# EAGLE schematic envirodinges (EAGLE 7.7.0)
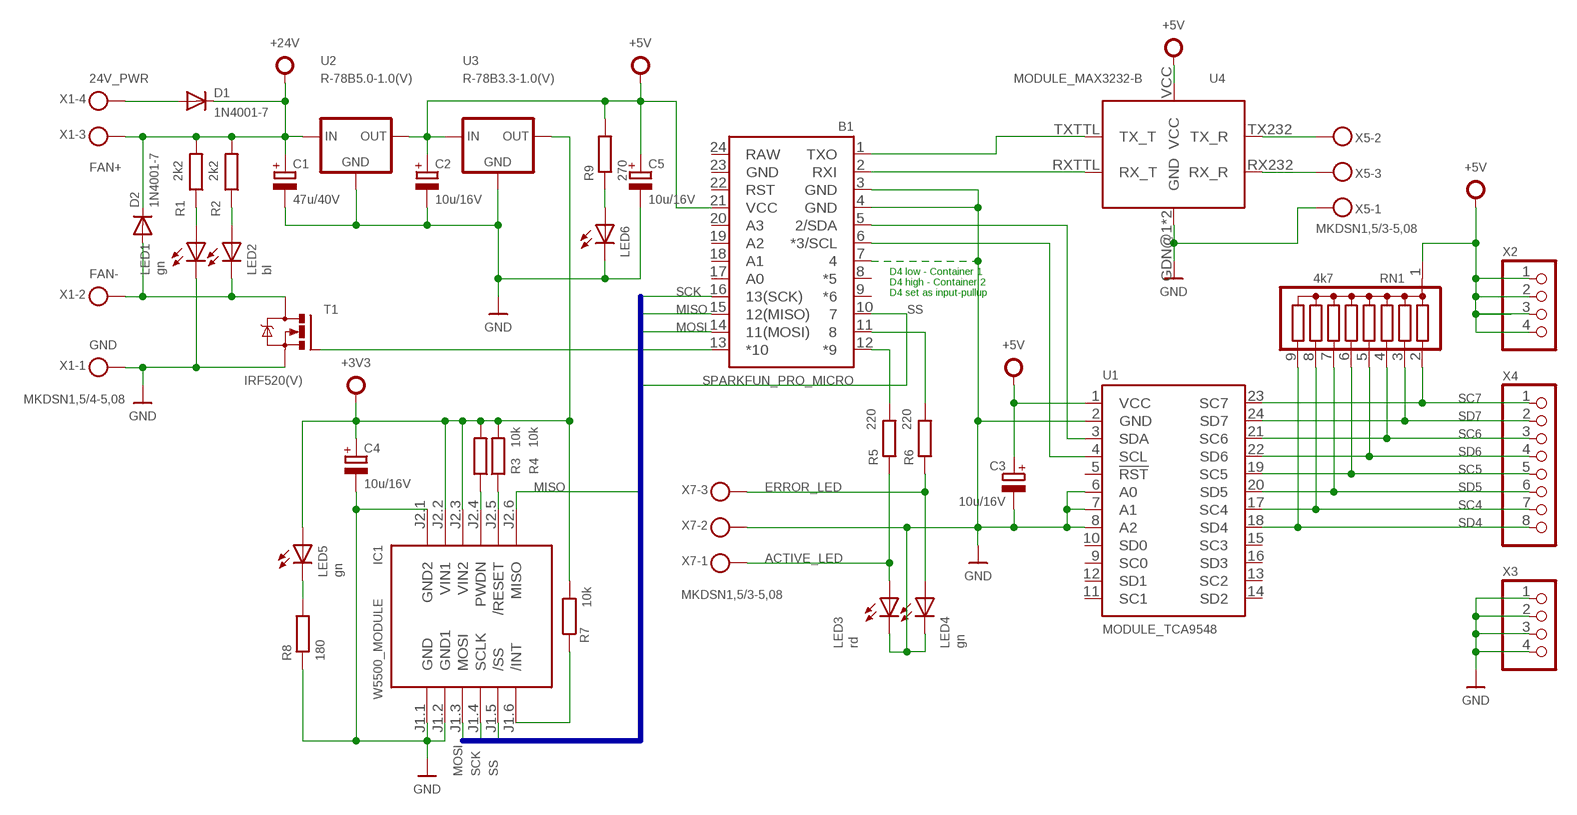
[diagram p0: schematic, sheet 1]

## Parts
B1  SPARKFUN_PRO_MICRO  [SPARKFUN_PRO_MICRO]
C1  47u/40V  CPOL-EUE5-4  [E5-4]
C2  10u/16V  CPOL-EUE5-4  [E5-4]
C3  10u/16V  CPOL-EUE5-4  [E5-4]
C4  10u/16V  CPOL-EUE5-4  [E5-4]
C5  10u/16V  CPOL-EUE5-4  [E5-4]
D1  1N4001-7  [DO41-7]
D2  1N4001-7  [DO41-7]
IC1  W5500_MODULE  WIZ820IO_DEVICE  [WIZ820IO]
LED1  gn  LED-3MM  [LED3MM]
LED2  bl  LED-3MM  [LED3MM]
LED3  rd  LED-3MM  [LED3MM]
LED4  gn  LED-3MM  [LED3MM]
LED5  gn  LED-3MM  [LED3MM]
LED6  LED-3MM  [LED3MM]
R1  2k2  R-EU0207/10  [0207/10]
R2  2k2  R-EU0207/10  [0207/10]
R3  10k  R-EU0207/10  [0207/10]
R4  10k  R-EU0207/10  [0207/10]
R5  220  R-EU0207/10  [0207/10]
R6  220  R-EU0207/10  [0207/10]
R7  10k  R-EU0207/10  [0207/10]
R8  180  R-EU0207/10  [0207/10]
R9  270  R-EU0207/10  [0207/10]
RN1  4k7  G08R  [SIL9]
T1  IRF520(V)  [TO220V]
U1  MODULE_TCA9548  TCA9548  [TCA9548]
U2  R-78B5.0-1.0(V)  [SIP3V]
U3  R-78B3.3-1.0(V)  [SIP3V]
U4  MODULE_MAX3232-B  [MAX3232-B]
X1  MKDSN1,5/4-5,08  [MKDSN1,5/4-5,08]
X2  MPT4  [4POL254]
X3  MPT4  [4POL254]
X4  MPT8  [8POL254]
X5  MKDSN1,5/3-5,08  [MKDSN1,5/3-5,08]
X7  MKDSN1,5/3-5,08  [MKDSN1,5/3-5,08]

## Nets
24V_PWR: D1.A X1.4
+3V3: C4.+ IC1.J2.2(VIN1) IC1.J2.3(VIN2) LED5.A R3.2 R4.2 R7.2 U3.3(OUT)
+5V: B1.21(VCC) C2.+ C3.+ C5.+ R9.2 RN1.1 U1.1(VCC) U2.3(OUT) U3.1(IN) U4.VCC X2.1 X2.2 X2.3 X2.4
ACTIVE_LED: LED3.A R5.1 X7.1
ERROR_LED: LED4.A R6.1 X7.3
FAN+: C1.+ D1.C D2.C R1.2 R2.2 U2.1(IN) X1.3 ; supply symbol labelled +24V
FAN-: D2.A LED2.K(C) T1.2(D) X1.2
GND: B1.3(GND) B1.4(GND) B1.7 C1.- C2.- C3.- C4.- C5.- IC1.J1.1(GND) IC1.J1.2(GND1) IC1.J2.1(GND2) LED1.K(C) LED3.K(C) LED4.K(C) LED6.K(C) R8.1 T1.3(S) U1.2(GND) U1.6(A0) U1.7(A1) U1.8(A2) U2.2(GND) U3.2(GND) U4.GDN@1(GND) U4.GND X1.1 X3.1 X3.2 X3.3 X3.4 X5.1 X7.2
MISO: B1.15(12(MISO)) IC1.J2.6(MISO)
MOSI: B1.14(11(MOSI)) IC1.J1.3(MOSI)
N$1: IC1.J1.6(/INT) R7.1
N$2: LED6.A R9.1
N$3: U4.RX232(RX_R) X5.3
N$4: LED5.K(C) R8.2
N$5: U4.TX232(TX_R) X5.2
N$9: IC1.J2.4(PWDN) R3.1
N$10: B1.5(2/SDA) U1.3(SDA)
N$11: B1.6(*3/SCL) U1.4(SCL)
N$12: IC1.J2.5(/RESET) R4.1
N$13: B1.13(*10) T1.1(G)
N$14: LED1.A R1.1
N$15: B1.1(TXO) U4.TXTTL(TX_T)
N$16: B1.2(RXI) U4.RXTTL(RX_T)
N$19: LED2.A R2.1
N$24: B1.12(*9) R5.2
N$25: B1.11 R6.2
SC4: RN1.8 U1.17(SC4) X4.7
SC5: RN1.6 U1.19(SC5) X4.5
SC6: RN1.4 U1.21(SC6) X4.3
SC7: RN1.2 U1.23(SC7) X4.1
SCK: B1.16(13(SCK)) IC1.J1.4(SCLK)
SD4: RN1.9 U1.18(SD4) X4.8
SD5: RN1.7 U1.20(SD5) X4.6
SD6: RN1.5 U1.22(SD6) X4.4
SD7: RN1.3 U1.24(SD7) X4.2
SS: B1.10 IC1.J1.5(/SS)
Unconnected: B1.8(*5) B1.9(*6) B1.17(A0) B1.18(A1) B1.19(A2) B1.20(A3) B1.22(RST) U1.5(!RST) U1.9(SC0) U1.10(SD0) U1.11(SC1) U1.12(SD1) U1.13(SC2) U1.14(SD2) U1.15(SC3) U1.16(SD3)

## Buses
MOSI,MISO,SCK,SS

## Notes on the sheet
- D4 low - Container 1
  D4 high - Container 2
  D4 set as input-pullup

## Power pins joined to a net without a drawn wire
GND: B1.23(GND)
RAW: B1.24(RAW)

## Library data of the parts
B1 = SparkFun-Boards:SPARKFUN_PRO_MICRO: SparkFun Pro Micro Atmega32U4 compatible footprint. SparkFun Products: 3.3V/8MHz <https://www.sparkfun.com/products/12587> 5V/16MHz <https://www.sparkfun.com/products/12640>
C1-C5 = rcl-rs:CPOL-EU: POLARIZED CAPACITOR, European symbol
D1 D2 = diode-rs:1N400*: DIODE general purpose rectifier, 1 A
IC1 = wiznet:WIZ820IO_DEVICE: WIZnet, WIZ820io plug in module incl. W5200 chip and MagJack
LED1-LED6 = led-rs:LED: LED OSRAM: - CHIPLED LG R971, LG N971, LY N971, LG Q971, LY Q971, LO R971, LY R971 LH N974, LH R974 LS Q976, LO Q976, LY Q976 LO Q996 - Hyper CHIPLED LW Q18S LB Q993, LB Q99A, LB R99A - SideLED LS A670, LO A670, LY A670, LG A670, LP A670 LB A673, LV A673, LT A673, LW A673 LH A674 LY A675 LS A676, LA A676, LO A676, LY A676, LW A676 LS A679, LY A679, LG A679 - Hyper Micro SIDELED® LS Y876, LA Y876, LO Y876, LY Y876 LT Y87S - SmartLED LW L88C, LW L88S LB L89C, LB L89S, LG L890 LS L89K, LO L89K, LY L89K LS L896, LA L896, LO L896, LY L896 - TOPLED LS T670, LO T670, LY T670, LG T670, LP T670 LSG T670, LSP T670, LSY T670, LOP T670, LYG T670 LG T671, LOG T671, LSG T671 LB T673, LV T673, LT T673, LW T673 LH T674 LS T676, LA T676, LO T676, LY T676, LB T676, LH T676, LSB T676, LW T676 LB T67C, LV T67C, LT T67C, LS T67K, LO T67K, LY T67K, LW E67C LS E67B, LA E67B, LO E67B, LY E67B, LB E67C, LV E67C, LT E67C LW T67C LS T679, LY T679, LG T679 LS T770, LO T770, LY T770, LG T770, LP T770 LB T773, LV T773, LT T773, LW T773 LH T774 LS E675, LA E675, LY E675, LS T675 LS T776, LA T776, LO T776, LY T776, LB T776 LHGB T686 LT T68C, LB T68C - Hyper Mini TOPLED® LB M676 - Mini TOPLED Santana® LG M470 LS M47K, LO M47K, LY M47K Source: http://www.osram.convergy.de LUXEON: - LUMILED® LXK2-PW12-R00, LXK2-PW12-S00, LXK2-PW14-U00, LXK2-PW14-V00 LXK2-PM12-R00, LXK2-PM12-S00, LXK2-PM14-U00 LXK2-PE12-Q00, LXK2-PE12-R00, LXK2-PE12-S00, LXK2-PE14-T00, LXK2-PE14-U00 LXK2-PB12-K00, LXK2-PB12-L00, LXK2-PB12-M00, LXK2-PB14-N00, LXK2-PB14-P00, LXK2-PB14-Q00 LXK2-PR12-L00, LXK2-PR12-M00, LXK2-PR14-Q00, LXK2-PR14-R00 LXK2-PD12-Q00, LXK2-PD12-R00, LXK2-PD12-S00 LXK2-PH12-R00, LXK2-PH12-S00 LXK2-PL12-P00, LXK2-PL12-Q00, LXK2-PL12-R00 Source: www.luxeon.com KINGBRIGHT: KA-3528ASYC Source: www.kingbright.com
R1-R9 = rcl-rs:R-EU: RESISTOR, European symbol
RN1 = resistor-sil:G08R: SIL RESISTOR
T1 = transistor-fetpwr:IRF520: N-FET 100V 10A 70W 0.27R HEXFET Power MOSFET
U1 = adafruit-rs:TCA9548
U2 U3 = v-reg_recom:R-78B*-1.0: RECOM R-78B**-* switching regulator (78xx compatible)
U4 = diy-modules:MODULE_MAX3232-B
X1 = con-phoenix-508:MKDSN1,5/4-5,08: MKDSN 1,5/ 4-5,08 Printklemme Nennstrom: 13,5 A Nennspannung: 250 V Rastermass: 5,08 mm Polzahl: 4 Anschlussart: Schraubanschluss Montage: Loeten Anschlussrichtung Leiter/Platine: 0 Artikelnummer: 1729144 Source: http://eshop.phoenixcontact.com .. 1729144.pdf
X2 X3 = con-phoenix-254:MPT4: PHOENIX CONNECTOR
X4 = con-phoenix-254:MPT8: PHOENIX CONNECTOR
X5 X7 = con-phoenix-508:MKDSN1,5/3-5,08: MKDSN 1,5/ 3-5,08 Printklemme Nennstrom: 13,5 A Nennspannung: 250 V Rastermass: 5,08 mm Polzahl: 3 Anschlussart: Schraubanschluss Montage: Loeten Anschlussrichtung Leiter/Platine: 0 Artikelnummer: 1729131 Source: http://eshop.phoenixcontact.com .. 1729131.pdf